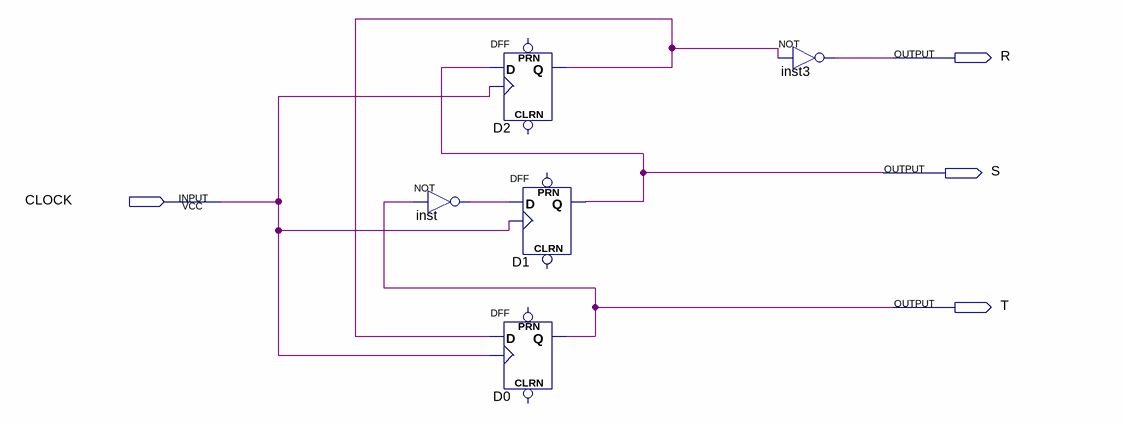
[diagram p0: schematic sheet]
// Quartus schematic GeradorRST.bdf as structural Verilog: 5 symbols, 4 pins
module GeradorRST (
  input  CLOCK,
  output R,
  output S,
  output T
);

  wire D2_q, inst_out;

  not inst (inst_out, T);
  DFF D2 (.CLK(CLOCK), .D(S), .Q(D2_q));  // open: CLRN, PRN
  DFF D0 (.CLK(CLOCK), .D(D2_q), .Q(T));  // open: CLRN, PRN
  DFF D1 (.CLK(CLOCK), .D(inst_out), .Q(S));  // open: CLRN, PRN
  not inst3 (R, D2_q);
endmodule
